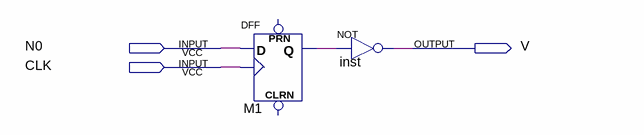
[diagram p0: schematic sheet]
// Quartus schematic maquina_1.bdf as structural Verilog: 2 symbols, 3 pins
module maquina_1 (
  input  N0,
  input  CLK,
  output V
);

  wire M1_q;

  DFF M1 (.CLK(CLK), .D(N0), .Q(M1_q));  // open: CLRN, PRN
  not inst (V, M1_q);
endmodule
